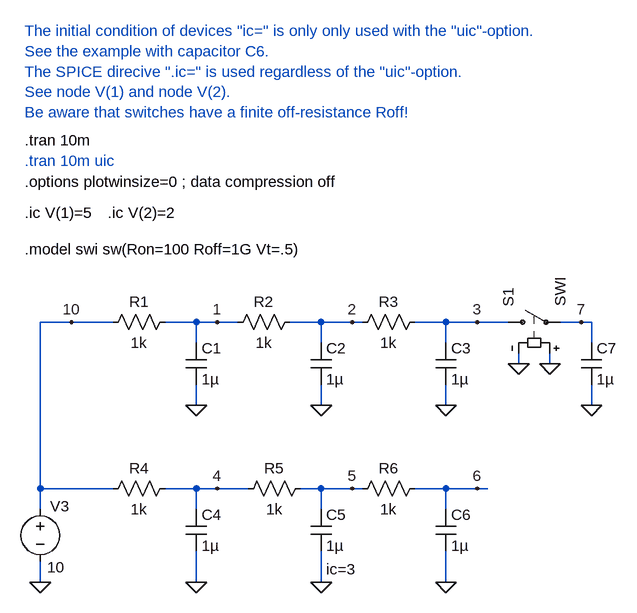
[diagram p0: schematic Ic_Uic_Test.asc]
Ic_Uic_Test.asc, the LTspice schematic file:
Version 4
SHEET 1 1232 996
WIRE -112 144 -160 144
WIRE -48 144 -112 144
WIRE 80 144 32 144
WIRE 112 144 80 144
WIRE 144 144 112 144
WIRE 272 144 224 144
WIRE 320 144 272 144
WIRE 336 144 320 144
WIRE 464 144 416 144
WIRE 512 144 464 144
WIRE 560 144 512 144
WIRE 672 144 640 144
WIRE 688 144 672 144
WIRE 80 176 80 144
WIRE 272 176 272 144
WIRE 464 176 464 144
WIRE 688 176 688 144
WIRE 576 208 576 192
WIRE 624 208 624 192
WIRE 80 272 80 240
WIRE 272 272 272 240
WIRE 464 272 464 240
WIRE 688 272 688 240
WIRE -160 400 -160 144
WIRE -48 400 -160 400
WIRE 80 400 32 400
WIRE 112 400 80 400
WIRE 160 400 112 400
WIRE 272 400 240 400
WIRE 320 400 272 400
WIRE 336 400 320 400
WIRE 464 400 416 400
WIRE 512 400 464 400
WIRE 528 400 512 400
WIRE -160 432 -160 400
WIRE 80 432 80 400
WIRE 272 432 272 400
WIRE 464 432 464 400
WIRE -160 544 -160 512
WIRE 80 544 80 496
WIRE 272 544 272 496
WIRE 464 544 464 496
FLAG -160 544 0
FLAG -112 144 10
FLAG 80 272 0
FLAG 80 544 0
FLAG 272 272 0
FLAG 272 544 0
FLAG 112 144 1
FLAG 320 144 2
FLAG 112 400 4
FLAG 320 400 5
FLAG 464 272 0
FLAG 512 144 3
FLAG 464 544 0
FLAG 512 400 6
FLAG 688 272 0
FLAG 672 144 7
FLAG 576 208 0
FLAG 624 208 0
SYMBOL voltage -160 416 R0
WINDOW 0 15 11 Left 0
WINDOW 3 11 105 Left 0
WINDOW 123 22 133 Left 0
WINDOW 39 0 0 Left 0
SYMATTR InstName V3
SYMATTR Value 10
SYMBOL res -64 416 R270
WINDOW 0 32 56 VTop 0
WINDOW 3 0 56 VBottom 0
SYMATTR InstName R4
SYMATTR Value 1k
SYMBOL res -64 160 R270
WINDOW 0 32 56 VTop 0
WINDOW 3 0 56 VBottom 0
SYMATTR InstName R1
SYMATTR Value 1k
SYMBOL cap 64 176 R0
SYMATTR InstName C1
SYMATTR Value 1µ
SYMBOL cap 64 432 R0
SYMATTR InstName C4
SYMATTR Value 1µ
SYMBOL res 144 416 R270
WINDOW 0 32 56 VTop 0
WINDOW 3 0 56 VBottom 0
SYMATTR InstName R5
SYMATTR Value 1k
SYMBOL res 128 160 R270
WINDOW 0 32 56 VTop 0
WINDOW 3 0 56 VBottom 0
SYMATTR InstName R2
SYMATTR Value 1k
SYMBOL cap 256 176 R0
SYMATTR InstName C2
SYMATTR Value 1µ
SYMBOL cap 256 432 R0
WINDOW 39 24 92 Left 0
SYMATTR InstName C5
SYMATTR Value 1µ
SYMATTR SpiceLine ic=3
SYMBOL res 320 160 R270
WINDOW 0 32 56 VTop 0
WINDOW 3 0 56 VBottom 0
SYMATTR InstName R3
SYMATTR Value 1k
SYMBOL cap 448 176 R0
SYMATTR InstName C3
SYMATTR Value 1µ
SYMBOL res 320 416 R270
WINDOW 0 32 56 VTop 0
WINDOW 3 0 56 VBottom 0
SYMATTR InstName R6
SYMATTR Value 1k
SYMBOL cap 448 432 R0
SYMATTR InstName C6
SYMATTR Value 1µ
SYMBOL cap 672 176 R0
SYMATTR InstName C7
SYMATTR Value 1µ
SYMBOL sw 544 144 R270
SYMATTR InstName S1
SYMATTR Value SWI
TEXT -184 -136 Left 0 !.tran 10m
TEXT -184 -72 Left 0 !.options plotwinsize=0 ; data compression off
TEXT -184 -24 Left 0 !.ic V(1)=5
TEXT -56 -24 Left 0 !.ic V(2)=2
TEXT -184 -104 Left 0 ;.tran 10m uic
TEXT -184 -304 Left 0 ;The initial condition of devices "ic=" is only only used with the "uic"-option.\nSee the example with capacitor C6.\nThe SPICE direcive ".ic=" is used regardless of the "uic"-option.\nSee node V(1) and node V(2).\nBe aware that switches have a finite off-resistance Roff!
TEXT -184 32 Left 0 !.model swi sw(Ron=100 Roff=1G Vt=.5)

The netlist it stands for:
* Ic_Uic_Test.asc
V3 10 0 10
R4 10 4 1k
R1 10 1 1k
C1 1 0 1µ
C4 4 0 1µ
R5 4 5 1k
R2 1 2 1k
C2 2 0 1µ
C5 5 0 1µ ic=3
R3 2 3 1k
C3 3 0 1µ
R6 5 6 1k
C6 6 0 1µ
C7 7 0 1µ
S1 3 7 0 0 SWI
.tran 10m
.options plotwinsize=0 ; data compression off
.ic V(1)=5
.ic V(2)=2
* .tran 10m uic
* The initial condition of devices "ic=" is only only used with the "uic"-option.
* See the example with capacitor C6.
* The SPICE direcive ".ic=" is used regardless of the "uic"-option.
* See node V(1) and node V(2).
* Be aware that switches have a finite off-resistance Roff!
.model swi sw(Ron=100 Roff=1G Vt=.5)
.backanno
.end